# EAGLE design RGBAmp (EAGLE 6.6.0)
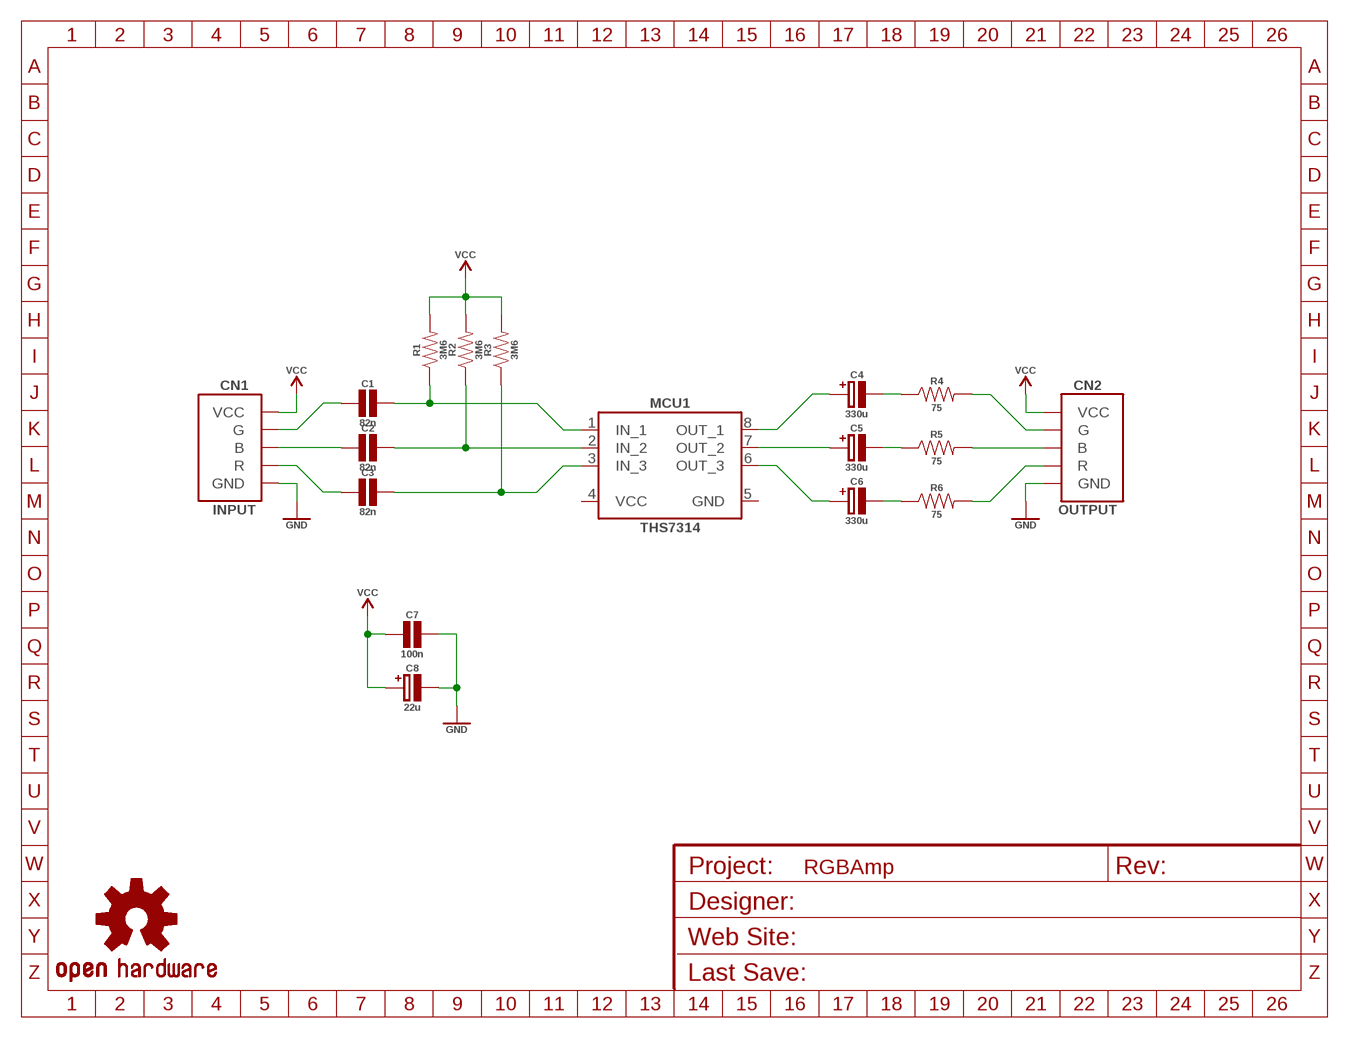
[diagram p0: schematic, sheet 1]
U$1 (FRAME_A5L): DESIGNER: Özay Turay a.k.a Simon/CGTr; REVISION: A 1.00; WEBSITE: http://www.commodore.gen.tr

## Parts
C1  82n  CAPACITOR_CERAMIC_1206  [CAPACITOR_CERAMIC_1206]
C2  82n  CAPACITOR_CERAMIC_1206  [CAPACITOR_CERAMIC_1206]
C3  82n  CAPACITOR_CERAMIC_1206  [CAPACITOR_CERAMIC_1206]
C4  330u  CAPACITOR_POLARIZED_6.3X7.7  [CAPACITOR_POLARIZED_6.3X7.7]
C5  330u  CAPACITOR_POLARIZED_6.3X7.7  [CAPACITOR_POLARIZED_6.3X7.7]
C6  330u  CAPACITOR_POLARIZED_6.3X7.7  [CAPACITOR_POLARIZED_6.3X7.7]
C7  100n  CAPACITOR_CERAMIC_1206  [CAPACITOR_CERAMIC_1206]
C8  22u  CAPACITOR_POLARIZED_6.3X7.7  [CAPACITOR_POLARIZED_6.3X7.7]
CN1  INPUT  GBR_PADS  [GBR_PADS]
CN2  OUTPUT  GBR_PADS  [GBR_PADS]
LOGO1  OSHW_LOGO_SMALL  [OSHW_LOGO_SMALL]
MCU1  THS7314  THS7314_SOP8  [SOP08]
R1  3M6  RESISTOR_SMT_1206  [RESISTOR_1206]
R2  3M6  RESISTOR_SMT_1206  [RESISTOR_1206]
R3  3M6  RESISTOR_SMT_1206  [RESISTOR_1206]
R4  75  RESISTOR_SMT_1206  [RESISTOR_1206]
R5  75  RESISTOR_SMT_1206  [RESISTOR_1206]
R6  75  RESISTOR_SMT_1206  [RESISTOR_1206]

## Nets
GND: C7.2 C8.- CN1.GND CN2.GND
N$1: C1.2 MCU1.1(IN_1) R1.1
N$2: C2.2 MCU1.2(IN_2) R2.1
N$3: C3.2 MCU1.3(IN_3) R3.1
N$4: C2.1 CN1.B
N$5: C1.1 CN1.G
N$6: C3.1 CN1.R
N$7: C4.+ MCU1.8(OUT_1)
N$8: C5.+ MCU1.7(OUT_2)
N$9: C6.+ MCU1.6(OUT_3)
N$10: C4.- R4.1
N$11: C5.- R5.1
N$12: C6.- R6.1
N$13: CN2.G R4.2
N$14: CN2.B R5.2
N$15: CN2.R R6.2
VCC: C7.1 C8.+ CN1.VCC CN2.VCC R1.2 R2.2 R3.2

## Power pins joined to a net without a drawn wire
GND: MCU1.5(GND)
VCC: MCU1.4(VCC)

## Library data of the parts
C1-C3 C7 = sj_standart:CAPACITOR_CERAMIC: Ceramic Capacitor
C4-C6 C8 = sj_standart:CAPACITOR_POLARIZED: Capacitor Polarized
CN1 CN2 = sj_connectors:GBR: GBR Pads
LOGO1 = sj_standart:OSHW_LOGO: Open Source Hardware Logo Device
MCU1 = sj_ic:THS7314: 3-Channel SDTV Video Amplifier With 5th-Order Filters and 6-dB Gain
R1-R6 = sj_standart:RESISTOR: Resistor

## Board
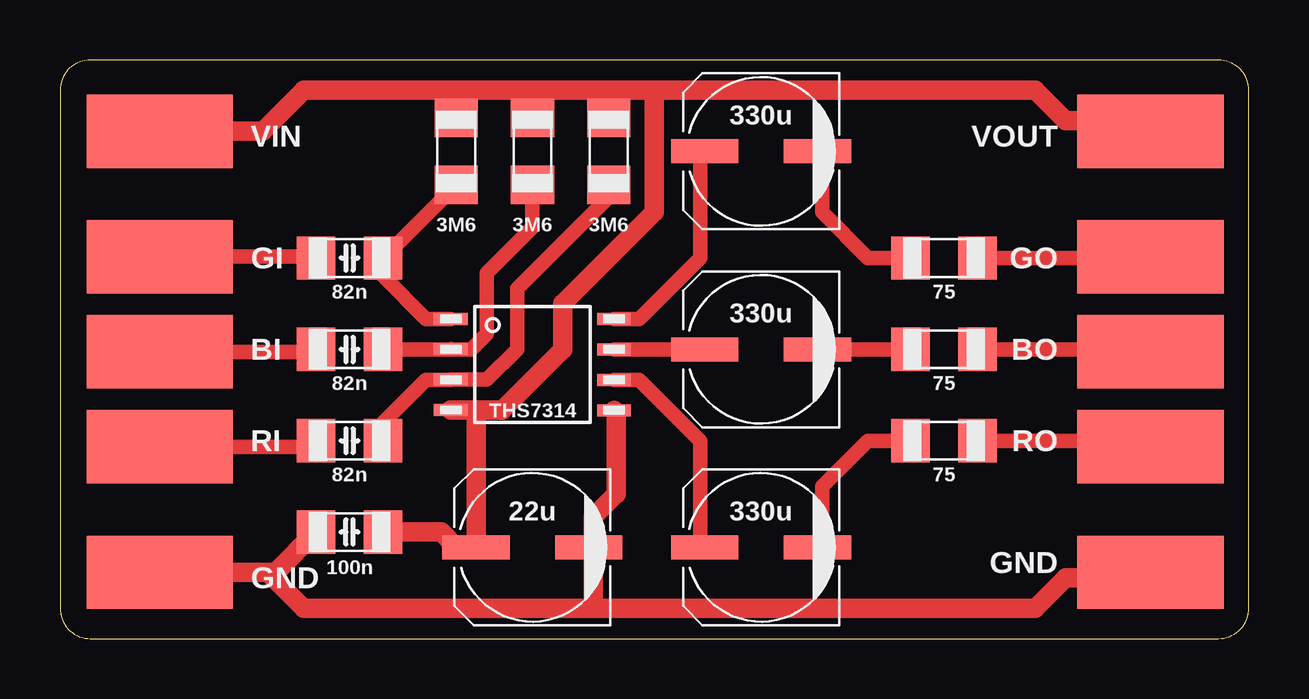
[diagram p1: board, top side]
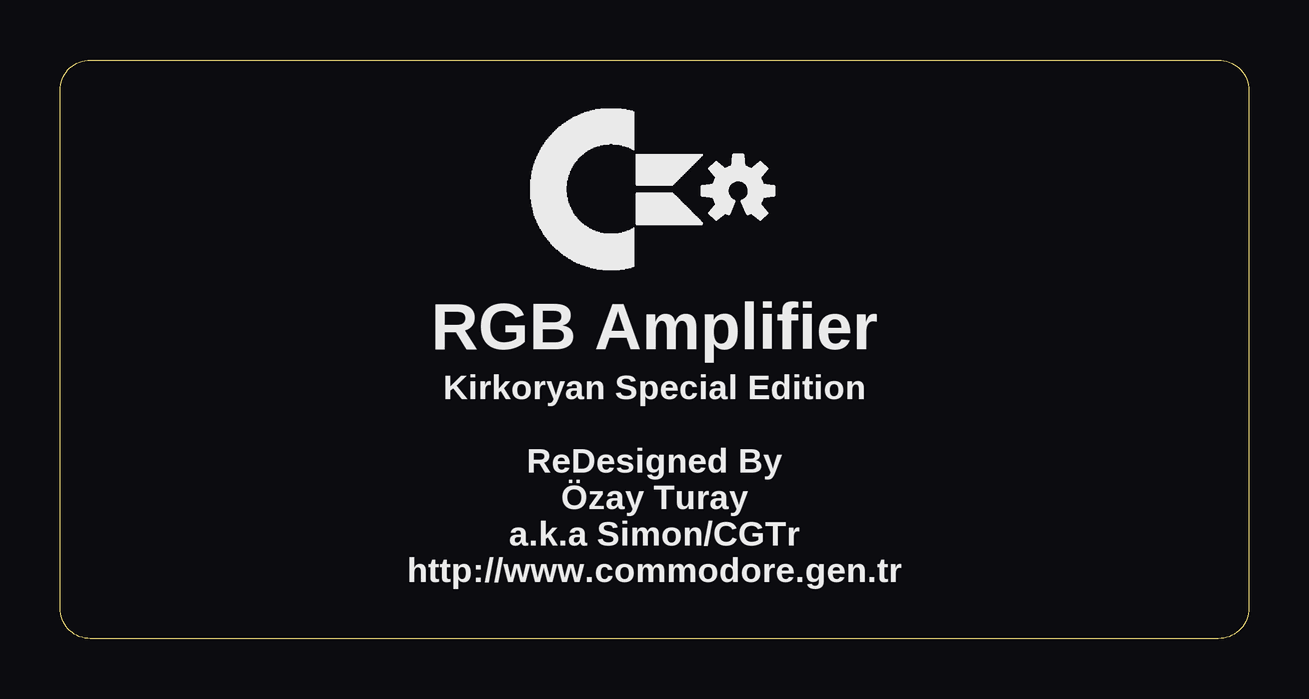
[diagram p2: board, bottom side, seen from below]

Size 49.53 x 24.13 mm. Coordinates in mm from the lower left corner, seen from the top.
Outline: 0,22.86 0,1.27 arc90 1.27,0 48.26,0 arc90 49.53,1.27 49.53,22.86 arc90 48.26,24.13 1.27,24.13 arc90 0,22.86
Copper layers (1*16): Top 0.035mm / dielectric 1.6mm / Bottom 0.035mm
Design rules "Elecrow": minimum track width 6mil, minimum drill 12mil, track to track 6mil, track to pad 6mil, pad to pad 6mil, via to via 8mil, smd to smd 0mil, copper to edge 20mil, drill to drill 10mil, minimum pad ring 6mil, minimum via ring 6mil, stop-mask expansion 0mil, vias tented up to drill 100mil, thermal gap 10mil

### Footprints (pad centres in the part's own frame; a part is rotated, then mirrored left to right if it is on the bottom)
CAPACITOR_CERAMIC_1206 = smd 1.6 x 1.8: 1 -1.4,0; 2 1.4,0
CAPACITOR_POLARIZED_6.3X7.7 = smd 2.8 x 1: + 2.35,0; - -2.35,0
GBR_PADS = smd 3.048 x 6.096: B 0.102,-0.289; G -3.858,-0.289; GND 9.292,-0.289; R 4.062,-0.289; VCC -9.088,-0.289
SOP08 = smd 0.5 x 1.4: 1 -1.905,-3.404; 2 -0.645,-3.404; 3 0.625,-3.404; 4 1.895,-3.404; 5 1.905,3.404; 6 0.635,3.404; 7 -0.635,3.404; 8 -1.905,3.404
RESISTOR_1206 = smd 1.6 x 1.8: 1 -1.4,0; 2 1.4,0

### Placement (x,y rotation side)
C1  12.06,15.88 0 top
C2  12.06,12.06 0 top
C3  12.06,8.26 0 top
C4  29.21,20.32 180 top
C5  29.21,12.06 180 top
C6  29.21,3.81 180 top
C7  12.06,4.45 180 top
C8  19.68,3.81 180 top
CN1  4.45,12.06 270 top
CN2  45.72,12.06 270 top
LOGO1  21.27,18.67 0 bottom
MCU1  19.68,11.43 270 top
R1  16.51,20.32 90 top
R2  19.68,20.32 90 top
R3  22.86,20.32 90 top
R4  36.83,15.88 0 top
R5  36.83,12.06 0 top
R6  36.83,8.26 0 top

### Tracks (layer width: path | path; a pad name or v marks a point on that pad's centre or on a via)
GND
  Top 0.813: CN1.GND 8.66,2.77 | 8.66,2.77 10.16,1.27 22.23,1.27 | 22.23,1.27 40.64,1.27 41.91,2.54 45.83,2.54 CN2.GND | C8.- 22.23,3.81 | 22.23,3.81 22.23,1.27 | 8.66,2.77 8.99,2.77 C7.2 | 22.23,3.81 22.23,5.08 23.18,6.03 23.18,9.44 MCU1.5
N$1
  Top 0.61: MCU1.1 15.24,13.34 13.46,15.11 C1.2 R1.1
N$2
  Top 0.61: C2.2 MCU1.2 16.29,12.06 17.14,12.06 17.78,12.7 17.78,15.24 19.68,17.14 R2.1
N$3
  Top 0.61: C3.2 13.46,9.02 15.24,10.79 MCU1.3 17.79,10.8 19.05,12.06 19.05,14.61 22.86,18.41 R3.1
N$4
  Top 0.61: CN1.B 10.56,11.96 C2.1
N$5
  Top 0.61: CN1.G 10.62,15.92 C1.1
N$6
  Top 0.61: CN1.R 10.41,8 C3.1
N$7
  Top 0.61: MCU1.8 24.13,13.34 26.67,15.88 26.67,20.13 C4.+
N$8
  Top 0.61: C5.+ MCU1.7
N$9
  Top 0.61: MCU1.6 24.13,10.79 26.67,8.26 26.67,4 C6.+
N$10
  Top 0.61: R4.1 33.66,15.88 31.75,17.78 31.75,20.13 C4.-
N$11
  Top 0.61: C5.- R5.1
N$12
  Top 0.61: R6.1 33.66,8.26 31.75,6.35 31.75,4 C6.-
N$13
  Top 0.61: R4.2 46.02,15.88 CN2.G
N$14
  Top 0.61: R5.2 45.96,12.06 CN2.B
N$15
  Top 0.61: R6.2 45.81,8.26 CN2.R
VCC
  Top 0.406: CN2.VCC 45.72,21.15 45.72,21.59 | 16.51,3.81 C8.+
  Top 0.813: CN1.VCC 8.45,21.15 10.16,22.86 16.51,22.86 | 16.51,22.86 19.68,22.86 | 19.68,22.86 22.86,22.86 | 22.86,22.86 24.77,22.86 | 24.77,22.86 40.64,22.86 41.91,21.59 45.72,21.59 | MCU1.4 17.14,9.54 | 17.14,9.54 18.41,9.54 18.41,9.53 20.95,12.06 20.95,13.97 24.77,17.78 24.77,22.86 | R1.2 16.51,22.86 | R2.2 19.68,22.86 | R3.2 22.86,22.86 | C8.+ 17.34,9.35 17.14,9.54 | C7.1 15.88,4.45 16.51,3.81

### Text on the board
tPlace: VIN | VOUT | GI | GO | BI | BO | RI | RO | GND | GND
bPlace: RGB Amplifier | Kirkoryan Special Edition / / ReDesigned By / Özay Turay / a.k.a Simon/CGTr / http://www.commodore.gen.tr